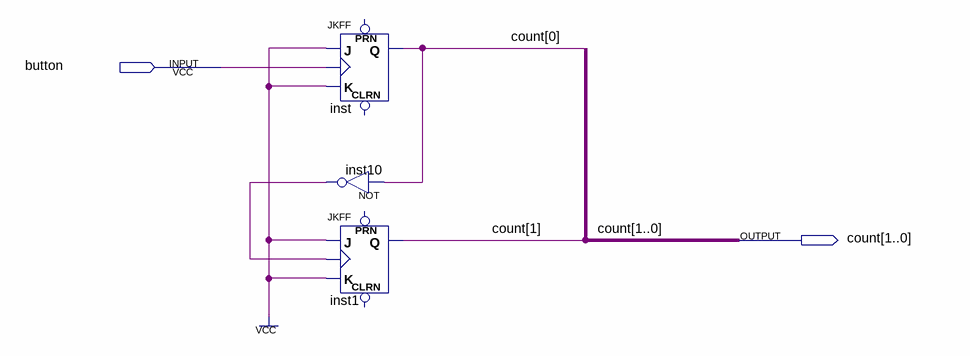
[diagram p0: schematic sheet]
// Quartus schematic count.bdf as structural Verilog: 3 symbols, 2 pins
module count (
  input  button,
  output [1:0] count
);

  wire inst10_out;

  JKFF inst (.K(1'b1), .J(1'b1), .CLK(button), .Q(count[0]));  // open: PRN, CLRN
  not inst10 (inst10_out, count[0]);
  JKFF inst1 (.K(1'b1), .J(1'b1), .CLK(inst10_out), .Q(count[1]));  // open: PRN, CLRN
endmodule
